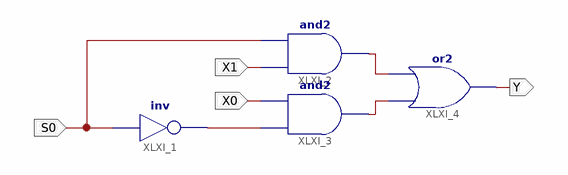
[diagram p0: schematic sheet 1]
// Xilinx ISE schematic MUX_2to1.sch (spartan3e) as structural Verilog: 4 symbols, 4 ports
module MUX_2to1 (
  input  S0,
  input  X1,
  input  X0,
  output Y
);

  wire XLXN_3, XLXN_7, XLXN_8;

  not XLXI_1 (XLXN_3, S0);
  and XLXI_2 (XLXN_7, X1, S0);
  and XLXI_3 (XLXN_8, XLXN_3, X0);
  or XLXI_4 (Y, XLXN_8, XLXN_7);
endmodule
